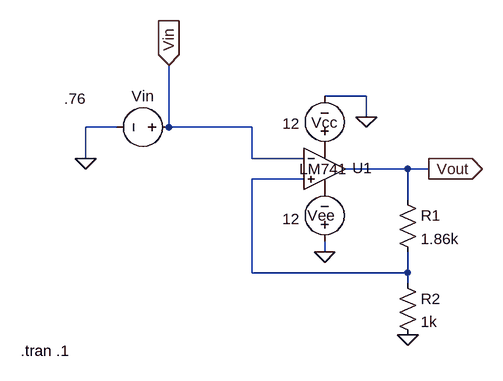
[diagram p0: schematic partB.asc]
partB.asc, the LTspice schematic file:
Version 4
SHEET 1 880 680
WIRE 240 96 176 96
WIRE 240 128 240 96
WIRE -144 144 -192 144
WIRE -64 144 -64 48
WIRE 64 144 -64 144
WIRE -192 192 -192 144
WIRE 64 192 64 144
WIRE 144 192 64 192
WIRE 304 208 208 208
WIRE 336 208 304 208
WIRE 144 224 64 224
WIRE 304 256 304 208
WIRE 176 336 176 320
WIRE 64 368 64 224
WIRE 304 368 304 336
WIRE 304 368 64 368
WIRE 304 384 304 368
FLAG -192 192 0
FLAG 240 128 0
FLAG 176 336 0
FLAG 336 208 Vout
IOPIN 336 208 Out
FLAG -64 48 Vin
IOPIN -64 48 In
FLAG 304 464 0
SYMBOL LM741 176 144 R0
WINDOW 0 43 63 Left 2
WINDOW 3 -39 64 Left 2
SYMATTR InstName U1
SYMBOL voltage -48 144 R90
WINDOW 0 -32 56 VBottom 2
WINDOW 3 -60 160 VTop 2
WINDOW 123 0 0 Left 0
WINDOW 39 0 0 Left 0
SYMATTR InstName Vin
SYMATTR Value .76
SYMBOL voltage 176 192 R180
WINDOW 0 -19 55 Left 2
WINDOW 3 38 54 Left 2
WINDOW 123 0 0 Left 0
WINDOW 39 0 0 Left 0
SYMATTR InstName Vcc
SYMATTR Value 12
SYMBOL voltage 176 336 R180
WINDOW 0 -16 56 Left 2
WINDOW 3 38 51 Left 2
WINDOW 123 0 0 Left 0
WINDOW 39 0 0 Left 0
SYMATTR InstName Vee
SYMATTR Value 12
SYMBOL res 288 240 R0
SYMATTR InstName R1
SYMATTR Value 1.86k
SYMBOL res 288 368 R0
SYMATTR InstName R2
SYMATTR Value 1k
TEXT -292 488 Left 2 !.tran .1

The netlist it stands for:
* partB.asc
XU1 N001 Vin P001 P002 Vout LM741  ; pins In+ In- V+ V- OUT
Vin Vin 0 .76
Vcc P001 0 12
Vee 0 P002 12
R1 Vout N001 1.86k
R2 N001 0 1k
.tran .1
.lib LM741.lib
.backanno
.end